# Altium schematic sheet DC_buck_converter_5V_OP..SchDoc: DC_Buck_Converter_5V
size A4; CheckedBy: Ignacio de Mendizabal; Author: Ravi Kumar Dusi; SheetNumber: 1; SheetTotal: 1
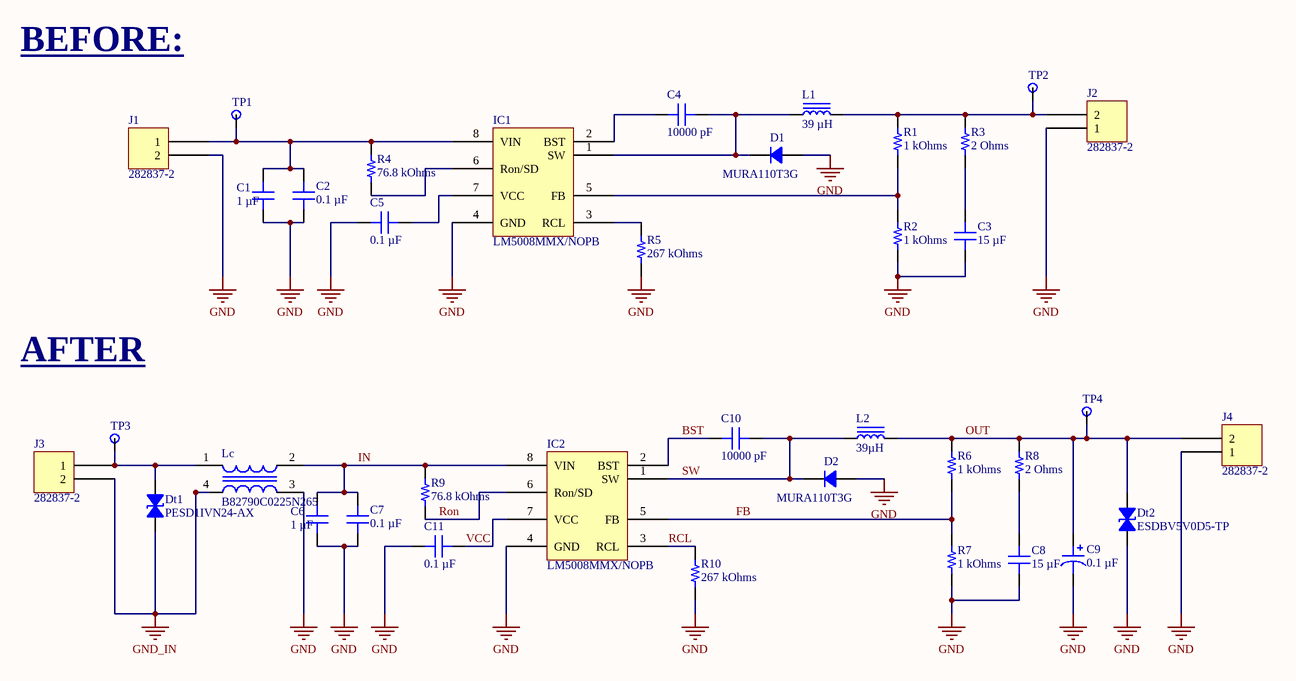
[diagram p0: DC_buck_converter_5V_OP..SchDoc]

## Parts
C1  1 µF  [CAP 0603_1608]
C2  0.1 µF  [CAP 0603_1608]
C3  15 µF  [CAP 0603_1608]
C4  10000 pF  [CAP 0603_1608]
C5  0.1 µF  [CAP 0603_1608]
C6  1 µF  [CAP 0603_1608]
C7  0.1 µF  [CAP 0603_1608]
C8  15 µF  [CAP 0603_1608]
C9  0.1 µF  [CAP POL 1206_3216]
C10  10000 pF  [CAP 0603_1608]
C11  0.1 µF  [CAP 0603_1608]
D1  MURA110T3G  [DO214AC SMA]
D2  MURA110T3G  [DO214AC SMA]
Dt1  PESD1IVN24-AX  [SOD323]
Dt2  ESDBV5V0D5-TP  [SOD523F]
IC1  LM5008MMX/NOPB  [TI VSSOP-8 DGK]
IC2  LM5008MMX/NOPB  [TI VSSOP-8 DGK]
J1  282837-2  [TE 282837-2]
J2  282837-2  [TE 282837-2]
J3  282837-2  [TE 282837-2]
J4  282837-2  [TE 282837-2]
L1  39 µH  [BOURNS SRR1280]
L2  39µH  [BOURNS SRR6028]
Lc  B82790C0225N265  [FL_B82790C0225N265]
R1  1 kOhms  [RES 0603_1608]
R2  1 kOhms  [RES 0603_1608]
R3  2 Ohms  [RES 0603_1608]
R4  76.8 kOhms  [RES 0603_1608]
R5  267 kOhms  [RES 0603_1608]
R6  1 kOhms  [RES 0603_1608]
R7  1 kOhms  [RES 0603_1608]
R8  2 Ohms  [RES 0603_1608]
R9  76.8 kOhms  [RES 0603_1608]
R10  267 kOhms  [RES 0603_1608]
TP1  TP_1  [Testpoint]  (value not drawn)  (no BOM)
TP2  TP_1  [Testpoint]  (value not drawn)  (no BOM)
TP3  TP_1  [Testpoint]  (value not drawn)  (no BOM)
TP4  TP_1  [Testpoint]  (value not drawn)  (no BOM)

## Nets
GND: C1.1 C2.1 C3.1 C5.2 C6.1 C7.1 C8.1 C9.2 C11.2 D1.1 D2.1 Dt2.1 IC1.4(GND) IC2.4(GND) J1.2 J2.1 J4.1 Lc.3 R2.1 R5.1 R7.1 R10.1
GND_IN: Dt1.1 J3.2 Lc.4
BST: C10.1 IC2.2(BST)
FB: IC2.5(FB) R6.1 R7.2
IN: C6.2 C7.2 IC2.8(VIN) Lc.2 R9.2
OUT: C9.1 Dt2.2 J4.2 L2.2 R6.2 R8.2
RCL: IC2.3(RCL) R10.2
Ron: IC2.6(Ron/SD) R9.1
SW: C10.2 D2.2 IC2.1(SW) L2.1
VCC: C11.1 IC2.7(VCC)
NetC1_2: C1.2 C2.2 IC1.8(VIN) J1.1 R4.2
NetC3_2: C3.2 R3.1
NetC4_1: C4.1 IC1.2(BST)
NetC4_2: C4.2 D1.2 IC1.1(SW) L1.1
NetC5_1: C5.1 IC1.7(VCC)
NetC8_2: C8.2 R8.1
NetDt1_2: Dt1.2 J3.1 Lc.1
NetIC1_3: IC1.3(RCL) R5.2
NetIC1_5: IC1.5(FB) R1.1 R2.2
NetIC1_6: IC1.6(Ron/SD) R4.1
NetJ2_2: J2.2 L1.2 R1.2 R3.2

## Notes on the sheet
- BEFORE:
- AFTER
- DOCUMENT NAME:
- TITLE:
- This document is created by Mitai. Any further questions can be asked through
- AUTHOR :
- REVIEWER:
- Sheet
- PART NO.:
- of
- *
- DATE:
- TEMPLATE:
- team@mitai.ai.
- A4
- Contact Address:Rosenheimer Straße 116b,81669, München.

## Library data of the parts
C1 C6 = UMK107ABJ105MAHT: CAP CER 1UF 50V X5R 0603; manufacturer: Taiyo Yuden; Tolerance: ±20%; Part Number: UMK107ABJ105MAHT; Value: 1 µF; Applications: Automotive, SMPS Filtering; Capacitance: 1 µF; componentlink1description: Datasheet; componentlink1url: https://www.yuden.co.jp/productdata/catalog/mlcc_all_hq_e.pdf; componentlink2description: DigiKey Link; componentlink2url: https://www.digikey.com/en/products/detail/taiyo-yuden/UMK107ABJ105MAHT/6563551; Device Package: 0603 (1608 Metric); lastupdated: 01/10/2023 19:09:10; Lifecycle Status: Active; Minimum Order: 1; Mounting Type: Surface Mount, MLCC; Operating Temperature: -55°C ~ 85°C; Package / Case: 0603 (1608 Metric); packaging: TapeAndReel; partid: 3194; Part Status: Active; price: 0.03; Ratings: AEC-Q200; series: M; Size / Dimension: 0.063" L x 0.031" W (1.60mm x 0.80mm); Supplier 1: DigiKey; Supplier Part Number 1: 587-4958-1-ND; Temperature Coefficient: X5R; Thickness (Max): 0.037" (0.95mm); Voltage - Rated: 50V
C2 C5 C7 C11 = C0603C104K5RAC7411: CAP CER 0.1UF 50V X7R 0603; manufacturer: KEMET; Tolerance: ±10%; Part Number: C0603C104K5RAC7411; Value: 0.1 µF; Applications: Bypass, Decoupling; Capacitance: 0.1 µF; componentlink1description: Datasheet; componentlink1url: https://api.kemet.com/component-edge/download/datasheet/C0603C104K5RAC7411.pdf; componentlink2description: DigiKey Link; componentlink2url: https://www.digikey.com/en/products/detail/kemet/C0603C104K5RAC7411/3317013; Device Package: 0603 (1608 Metric); lastupdated: 01/10/2023 19:09:12; Lifecycle Status: Active; Minimum Order: 1; Mounting Type: Surface Mount, MLCC; Operating Temperature: -55°C ~ 125°C; Package / Case: 0603 (1608 Metric); packaging: TapeAndReel; partid: 2233; Part Status: Active; price: 0.01; series: SMD Comm X7R; Size / Dimension: 0.063" L x 0.031" W (1.60mm x 0.80mm); Supplier 1: DigiKey; Supplier Part Number 1: 399-C0603C104K5RAC7411CT-ND; Temperature Coefficient: X7R; Thickness (Max): 0.035" (0.90mm); Voltage - Rated: 50V
C3 = C1608X5R0J156M080AC: CAP CER 15UF 6.3V X5R 0603; manufacturer: TDK Corporation; Tolerance: ±20%; Part Number: C1608X5R0J156M080AC; Value: 15 µF; Applications: General Purpose; Capacitance: 15 µF; componentlink1description: Datasheet; componentlink1url: https://product.tdk.com/info/en/catalog/datasheets/mlcc_commercial_general_en.pdf?ref_disty=digikey; componentlink2description: DigiKey Link; componentlink2url: https://www.digikey.com/en/products/detail/tdk-corporation/C1608X5R0J156M080AC/2792253; Device Package: 0603 (1608 Metric); Features: Low ESL; lastupdated: 01/10/2023 19:09:11; Lifecycle Status: Active; Minimum Order: 1; Mounting Type: Surface Mount, MLCC; Operating Temperature: -55°C ~ 85°C; Package / Case: 0603 (1608 Metric); packaging: TapeAndReel; partid: 2610; Part Status: Active; price: 0.07; series: C; Size / Dimension: 0.063" L x 0.031" W (1.60mm x 0.80mm); Supplier 1: DigiKey; Supplier Part Number 1: 445-8027-1-ND; Temperature Coefficient: X5R; Thickness (Max): 0.039" (1.00mm); Voltage - Rated: 6.3V
C4 C10 = AC0603KRX7R0BB103: CAP CER 10000PF 100V X7R 0603; manufacturer: Yageo; Tolerance: ±10%; Part Number: AC0603KRX7R0BB103; Value: 10000 pF; Applications: Automotive; Capacitance: 10000 pF; componentlink1description: Datasheet; componentlink1url: http://www.yageo.com/NewPortal/_en/search/productDocs.jsp?YageoPartNumber=AC0603KRX7R0BB103; componentlink2description: DigiKey Link; componentlink2url: https://www.digikey.com/en/products/detail/yageo/AC0603KRX7R0BB103/6643086; Device Package: 0603 (1608 Metric); lastupdated: 01/10/2023 19:09:12; Lifecycle Status: Active; Minimum Order: 1; Mounting Type: Surface Mount, MLCC; Operating Temperature: -55°C ~ 125°C; Package / Case: 0603 (1608 Metric); packaging: TapeAndReel; partid: 2218; Part Status: Active; price: 0.01; Ratings: AEC-Q200; series: AC; Size / Dimension: 0.063" L x 0.031" W (1.60mm x 0.80mm); Supplier 1: DigiKey; Supplier Part Number 1: 311-3100-1-ND; Temperature Coefficient: X7R; Thickness (Max): 0.035" (0.90mm); Voltage - Rated: 100V
C8 = C1608X5R1A156M080AC: CAP CER 15UF 10V X5R 0603; manufacturer: TDK Corporation; Tolerance: ±20%; Part Number: C1608X5R1A156M080AC; Value: 15 µF; Applications: General Purpose; Capacitance: 15 µF; componentlink1description: Datasheet; componentlink1url: https://product.tdk.com/info/en/catalog/datasheets/mlcc_commercial_general_en.pdf?ref_disty=digikey; componentlink2description: DigiKey Link; componentlink2url: https://www.digikey.com/en/products/detail/tdk-corporation/C1608X5R1A156M080AC/3661558; Device Package: 0603 (1608 Metric); Features: Low ESL; lastupdated: 26/11/2023 20:10:06; Lifecycle Status: Active; Minimum Order: 1; Mounting Type: Surface Mount, MLCC; Operating Temperature: -55°C ~ 85°C; Package / Case: 0603 (1608 Metric); packaging: TapeAndReel; partid: 18683; Part Status: Active; price: 0.07; series: C; Size / Dimension: 0.063" L x 0.031" W (1.60mm x 0.80mm); Supplier 1: DigiKey; Supplier Part Number 1: 445-9117-1-ND; Temperature Coefficient: X5R; Thickness (Max): 0.039" (1.00mm); Voltage - Rated: 10V
C9 = T494A104K035AT: CAP TANT 0.1UF 10% 35V 1206; manufacturer: KEMET; Manufacturer Size Code: A; ESR (Equivalent Series Resistance): 10Ohm; Lifetime @ Temp.: 2000 Hrs @ 125°C; Type: Molded; Part Number: T494A104K035AT; Value: 0.1 µF; Capacitance: 0.1 µF; componentlink1description: Datasheet; componentlink1url: https://api.kemet.com/component-edge/download/datasheet/T494A104K035AT.pdf; componentlink2description: DigiKey Link; componentlink2url: https://www.digikey.com/en/products/detail/kemet/T494A104K035AT/3759695; Device Package: 1206 (3216 Metric); Features: General Purpose; Height - Seated (Max): 0.071" (1.80mm); lastupdated: 26/11/2023 21:00:31; Lifecycle Status: Active; Minimum Order: 1; Mounting Type: Surface Mount; Operating Temperature: -55°C ~ 125°C; Package / Case: 1206 (3216 Metric); packaging: TapeAndReel; partid: 208; Part Status: Active; price: 0.14; series: T494; Size / Dimension: 0.126" L x 0.063" W (3.20mm x 1.60mm); Supplier 1: DigiKey; Supplier Part Number 1: 399-10216-1-ND; Tolerance: ±10%; Voltage - Rated: 35 V
D1 D2 = MURA110T3G: DIODE GEN PURP 100V 2A SMA; Manufacturer: ON Semiconductor; Current - Reverse Leakage @ Vr: 2µA @ 100V; Diode Type: Standard; Reverse Recovery Time (trr): 30ns; Speed: Fast Recovery =< 500ns, > 200mA (Io); Voltage - Forward (Vf) (Max) @ If: 875mV @ 1A; Part Number: MURA110T3G; ComponentLink1Description: Datasheet; ComponentLink1URL: //media.digikey.com/pdf/Data%20Sheets/ON%20Semiconductor%20PDFs/MURA105T3-D.pdf; ComponentLink2Description: DigiKey Link; ComponentLink2URL: http://digikey.com/product-detail/en/on-semiconductor/MURA110T3G/MURA110T3GOSCT-ND/964568; Current - Average Rectified (Io): 2A; LastUpdated: 01/10/2023 20:19:19; Lifecycle Status: Active; Minimum Order: 1; Mounting Type: Surface Mount; Operating Temperature - Junction: -65°C ~ 175°C; Package / Case: DO-214AC, SMA; Packaging: TapeAndReel; PartId: 641; Part Status: Active; Price: 0.10; Series: -; Supplier 1: DigiKey; Supplier Part Number 1: MURA110T3GOSCT-ND; Supplier Device Package: SMA; Voltage - DC Reverse (Vr) (Max): 100V
Dt1 = PESD1IVN24-AX: TVS DIODE 24VWM 42VC SOD323; Manufacturer: Nexperia USA Inc.; Bidirectional Channels: 1; Capacitance @ Frequency: 14pF @ 1MHz; Current - Peak Pulse (10/1000µs): 3.5A (8/20µs); Power Line Protection: No; Voltage - Breakdown (Min): 25.5V; Voltage - Clamping (Max) @ Ipp: 42V; Voltage - Reverse Standoff (Typ): 24V (Max); Part Number: PESD1IVN24-AX; Applications: CAN; ComponentLink1Description: Datasheet; ComponentLink1URL: https://assets.nexperia.com/documents/data-sheet/PESD1IVN24-A.pdf; ComponentLink2Description: DigiKey Link; ComponentLink2URL: https://www.digikey.com/en/products/detail/nexperia-usa-inc/PESD1IVN24-AX/8131025; LastUpdated: 04/12/2023 21:44:28; Lifecycle Status: Active; Minimum Order: 1; Mounting Type: Surface Mount; Operating Temperature: -55°C ~ 150°C (TA); Package / Case: SC-76, SOD-323; Packaging: TapeAndReel; PartId: 9975; Part Status: Active; Price: 0.04; Series: -; Supplier 1: DigiKey; Supplier Part Number 1: 1727-7620-1-ND; Supplier Device Package: SOD-323; Type: Zener
Dt2 = ESDBV5V0D5-TP: TVS DIODE 5VWM 13VC SOD523; Manufacturer: Micro Commercial Co; Bidirectional Channels: 1; Capacitance @ Frequency: 3pF @ 1MHz; Current - Peak Pulse (10/1000µs): 4A (8/20µs); Power Line Protection: No; Power - Peak Pulse: 52W; Voltage - Breakdown (Min): 5.6V; Voltage - Clamping (Max) @ Ipp: 13V; Voltage - Reverse Standoff (Typ): 5V (Max); Part Number: ESDBV5V0D5-TP; Applications: General Purpose; ComponentLink1Description: Datasheet; ComponentLink1URL: https://www.mccsemi.com/pdf/Products/ESDBV5V0D5(SOD-523)-A.pdf; ComponentLink2Description: DigiKey Link; ComponentLink2URL: https://www.digikey.com/en/products/detail/micro-commercial-co/ESDBV5V0D5-TP/8554662; LastUpdated: 04/12/2023 21:44:21; Lifecycle Status: Active; Minimum Order: 1; Mounting Type: Surface Mount; Operating Temperature: -55°C ~ 150°C (TJ); Package / Case: SC-79, SOD-523; Packaging: TapeAndReel; PartId: 9797; Part Status: Active; Price: 0.06; Series: -; Supplier 1: DigiKey; Supplier Part Number 1: 353-ESDBV5V0D5-TPCT-ND; Supplier Device Package: SOD-523; Type: Zener; Unidirectional Channels: 1
IC1 IC2 = LM5008MMX/NOPB: IC REG BUCK ADJ 350MA 8VSSOP; Manufacturer: Texas Instruments; Frequency - Switching: 50kHz ~ 600kHz; Function: Step-Down; Number of Outputs: 1; Output Configuration: Positive; Output Type: Adjustable; Synchronous Rectifier: No; Voltage - Input (Max): 95V; Voltage - Input (Min): 9.5V; Voltage - Output (Max): 75V; Voltage - Output (Min/Fixed): 2.5V; Part Number: LM5008MMX/NOPB; ComponentLink1Description: Datasheet; ComponentLink1URL: http://www.ti.com/general/docs/suppproductinfo.tsp?distId=10&gotoUrl=http%3A%2F%2Fwww.ti.com%2Flit%2Fgpn%2Flm5008; ComponentLink2Description: DigiKey Link; ComponentLink2URL: //digikey.com/product-detail/en/texas-instruments/LM5008MMX-NOPB/296-35288-2-ND/1871803; Current - Output: 350mA; Device Package: 8-TSSOP, 8-MSOP (0.118", 3.00mm Width); LastUpdated: 12/12/2019 10:27:36; Lifecycle Status: 0; Minimum Order: 1; Mounting Type: Surface Mount; Operating Temperature: -40°C ~ 125°C (TJ); Package / Case: 8-TSSOP, 8-MSOP (0.118", 3.00mm Width); Packaging: TapeAndReel; Part Status: Active; Price: 1.30; Series: -; Supplier 1: DigiKey; Supplier Part Number 1: 296-35288-2-ND; Supplier Device Package: 8-VSSOP; Topology: Buck
J1-J4 = 282837-2: TERM BLK 2P SIDE ENT 5.08MM PCB; Manufacturer: TE Connectivity AMP Connectors; Current: 13.5 A; Mating Orientation: Horizontal with Board; Number of Levels: 1; Pitch: 0.200" (5.08mm); Positions Per Level: 2; Voltage: 300 V; Wire Gauge: 16-28 AWG; Wire Termination: Screw - Rising Cage Clamp; Part Number: 282837-2; Color: Green; ComponentLink1Description: Datasheet; ComponentLink1URL: https://www.te.com/commerce/DocumentDelivery/DDEController?Action=srchrtrv&DocNm=282837&DocType=Customer+Drawing&DocLang=English; ComponentLink2Description: DigiKey Link; ComponentLink2URL: https://www.digikey.com/en/products/detail/te-connectivity-amp-connectors/282837-2/2187973; Features: Interlocking (Side); LastUpdated: 21/06/2022 15:00:23; Lifecycle Status: Active; Minimum Order: 1; Mounting Type: Through Hole; Packaging: Tray; Part Status: Active; Price: 0.31; Series: Buchanan; Supplier 1: DigiKey; Supplier Part Number 1: A113320-ND
L1 = SRR1280-390M: FIXED IND 39UH 3.2A 70 MOHM SMD; Manufacturer: Bourns Inc.; Current - Saturation: 3.1A; DC Resistance (DCR): 70mOhm Max; Frequency - Self Resonant: 8.5MHz; Inductance Frequency - Test: 100 kHz; Material - Core: Ferrite; Q @ Freq: 24 @ 2.52MHz; Shielding: Shielded; Tolerance: ±20%; Type: Drum Core, Wirewound; Part Number: SRR1280-390M; ComponentLink1Description: Datasheet; ComponentLink1URL: https://www.bourns.com/docs/Product-Datasheets/SRR1280.pdf; ComponentLink2Description: DigiKey Link; ComponentLink2URL: https://www.digikey.com/en/products/detail/bourns-inc/SRR1280-390M/1969999; Current Rating (Amps): 3.2 A; Device Package: Nonstandard; Height - Seated (Max): 0.315" (8.00mm); Inductance: 39 µH; LastUpdated: 01/10/2023 20:27:20; Lifecycle Status: Active; Minimum Order: 1; Mounting Type: Surface Mount; Operating Temperature: -40°C ~ 125°C; Package / Case: Nonstandard; Packaging: TapeAndReel; PartId: 15; Part Status: Active; Price: 0.51; Series: SRR1280; Size / Dimension: 0.492" L x 0.492" W (12.50mm x 12.50mm); Supplier 1: DigiKey; Supplier Part Number 1: 118-SRR1280-390MCT-ND; Value: 39 µH
L2 = SRR6028-390Y: FIXED IND 39UH 1A 195 MOHM SMD; Manufacturer: Bourns Inc.; Current - Saturation: 750mA; DC Resistance (DCR): 195mOhm Max; Frequency - Self Resonant: 17MHz; Inductance Frequency - Test: 100kHz; Material - Core: Ferrite; Q @ Freq: 10 @ 2.52MHz; Shielding: Shielded; Tolerance: ±30%; Type: Wirewound; Part Number: SRR6028-390Y; ComponentLink1Description: Datasheet; ComponentLink1URL: https://www.bourns.com/docs/Product-Datasheets/SRR6028.pdf; ComponentLink2Description: DigiKey Link; ComponentLink2URL: http://digikey.com/product-detail/en/bourns-inc/SRR6028-390Y/SRR6028-390YCT-ND/2127560; Current Rating (Amps): 1A; Device Package: Nonstandard; Height - Seated (Max): 0.118" (3.00mm); Inductance: 39µH; LastUpdated: 26/11/2023 21:31:01; Lifecycle Status: Active; Minimum Order: 1; Mounting Type: Surface Mount; Operating Temperature: -40°C ~ 125°C; Package / Case: Nonstandard; Packaging: TapeAndReel; PartId: 47; Part Status: Active; Price: 0.40; Series: SRR6028; Size / Dimension: 0.268" L x 0.268" W (6.80mm x 6.80mm); Supplier 1: DigiKey; Supplier Part Number 1: SRR6028-390YCT-ND; Value: 39µH
Lc = B82790C0225N265: Common Mode Filter / Choke, 0.005 - 4.7 mH, 200 - 1000 mA; MF: EPCOS; SnapEDA_Link: https://www.snapeda.com/parts/B82790C0225N265/EPCOS/view-part/?ref=snap; Package: NON STANDARD-4 TDK; Value: *; MP: B82790C0225N265; Check_prices: https://www.snapeda.com/parts/B82790C0225N265/EPCOS/view-part/?ref=eda
R1 R2 R6 R7 = AT0603DRD071KL: RES SMD 1K OHM 0.5% 1/10W 0603; Manufacturer: Yageo; Power (Watts): 0.1W, 1/10W; Temperature Coefficient: ±25ppm/°C; Part Number: AT0603DRD071KL; Value: 1 kOhms; ComponentLink1Description: Datasheet; ComponentLink1URL: http://www.yageo.com/documents/recent/PYu-AT_51_RoHS_L_5.pdf; ComponentLink2Description: DigiKey Link; ComponentLink2URL: https://www.digikey.com/en/products/detail/yageo/AT0603DRD071KL/5138634; Composition: Thin Film; Device Package: 0603 (1608 Metric); Features: Anti-Sulfur, Automotive AEC-Q200, Moisture Resistant; Height - Seated (Max): 0.022" (0.55mm); LastUpdated: 01/10/2023 19:35:39; Lifecycle Status: Active; Minimum Order: 1; Number of Terminations: 2; Operating Temperature: -55°C ~ 155°C; Package / Case: 0603 (1608 Metric); Packaging: TapeAndReel; PartId: 4899; Part Status: Active; Price: 0.02; Ratings: AEC-Q200; Resistance: 1 kOhms; Series: AT; Size / Dimension: 0.063" L x 0.031" W (1.60mm x 0.80mm); Supplier 1: DigiKey; Supplier Part Number 1: YAG2115CT-ND; Supplier Device Package: 0603; Tolerance: ±0.5%
R3 R8 = SFR03EZPJ2R0: SULFUR TOLERANT CHIP RESISTORS; Manufacturer: Rohm Semiconductor; Power (Watts): 0.1W, 1/10W; Temperature Coefficient: ±400ppm/°C; Tolerance: ±5%; Part Number: SFR03EZPJ2R0; Value: 2 Ohms; ComponentLink1Description: Datasheet; ComponentLink1URL: https://fscdn.rohm.com/en/products/databook/datasheet/passive/resistor/chip_resistor/sfr-e.pdf; ComponentLink2Description: DigiKey Link; ComponentLink2URL: https://www.digikey.com/en/products/detail/rohm-semiconductor/SFR03EZPJ2R0/16179956; Composition: Thick Film; Device Package: 0603 (1608 Metric); Features: Anti-Sulfur, Automotive AEC-Q200; Height - Seated (Max): 0.022" (0.55mm); LastUpdated: 01/10/2023 19:33:15; Lifecycle Status: Active; Minimum Order: 1; Number of Terminations: 2; Operating Temperature: -55°C ~ 155°C; Package / Case: 0603 (1608 Metric); Packaging: TapeAndReel; PartId: 68512; Part Status: Active; Price: 0.01; Ratings: AEC-Q200; Resistance: 2 Ohms; Series: SFR; Size / Dimension: 0.063" L x 0.031" W (1.60mm x 0.80mm); Supplier 1: DigiKey; Supplier Part Number 1: 511-SFR03EZPJ2R0CT-ND; Supplier Device Package: 0603
R4 R9 = RG1608P-7682-B-T5: RES SMD 76.8KOHM 0.1% 1/10W 0603; Manufacturer: Susumu; Power (Watts): 0.1W, 1/10W; Temperature Coefficient: ±25ppm/°C; Part Number: RG1608P-7682-B-T5; Value: 76.8 kOhms; ComponentLink1Description: Datasheet; ComponentLink1URL: //media.digikey.com/pdf/Data%20Sheets/Susumu%20PDFs/RG_RM_RGH_Oct2012.pdf; ComponentLink2Description: DigiKey Link; ComponentLink2URL: https://www.digikey.com/en/products/detail/susumu/RG1608P-7682-B-T5/1240630; Composition: Thin Film; Device Package: 0603 (1608 Metric); Features: Anti-Sulfur, Automotive AEC-Q200; Height - Seated (Max): 0.020" (0.50mm); LastUpdated: 01/10/2023 19:35:32; Lifecycle Status: Active; Minimum Order: 1; Number of Terminations: 2; Operating Temperature: -55°C ~ 155°C; Package / Case: 0603 (1608 Metric); Packaging: TapeAndReel; PartId: 6774; Part Status: Active; Price: 0.05; Ratings: AEC-Q200; Resistance: 76.8 kOhms; Series: RG; Size / Dimension: 0.063" L x 0.031" W (1.60mm x 0.80mm); Supplier 1: DigiKey; Supplier Part Number 1: RG16P76.8KBCT-ND; Supplier Device Package: 0603; Tolerance: ±0.1%
R5 R10 = RT0603BRD07267KL: RES SMD 267K OHM 0.1% 1/10W 0603; Manufacturer: Yageo; Power (Watts): 0.1W, 1/10W; Temperature Coefficient: ±25ppm/°C; Part Number: RT0603BRD07267KL; Value: 267 kOhms; ComponentLink1Description: Datasheet; ComponentLink1URL: https://www.yageo.com/upload/media/product/productsearch/datasheet/rchip/PYu-RT_1-to-0.01_RoHS_L_11.pdf; ComponentLink2Description: DigiKey Link; ComponentLink2URL: https://www.digikey.com/en/products/detail/yageo/RT0603BRD07267KL/1072399; Composition: Thin Film; Device Package: 0603 (1608 Metric); Height - Seated (Max): 0.022" (0.55mm); LastUpdated: 01/10/2023 19:35:34; Lifecycle Status: Active; Minimum Order: 1; Number of Terminations: 2; Operating Temperature: -55°C ~ 155°C; Package / Case: 0603 (1608 Metric); Packaging: TapeAndReel; PartId: 6334; Part Status: Active; Price: 0.03; Resistance: 267 kOhms; Series: RT; Size / Dimension: 0.063" L x 0.031" W (1.60mm x 0.80mm); Supplier 1: DigiKey; Supplier Part Number 1: YAG4514CT-ND; Supplier Device Package: 0603; Tolerance: ±0.1%
TP1-TP4 = Testpoint